# Altium schematic sheet Mostek H.SchDoc
size A4
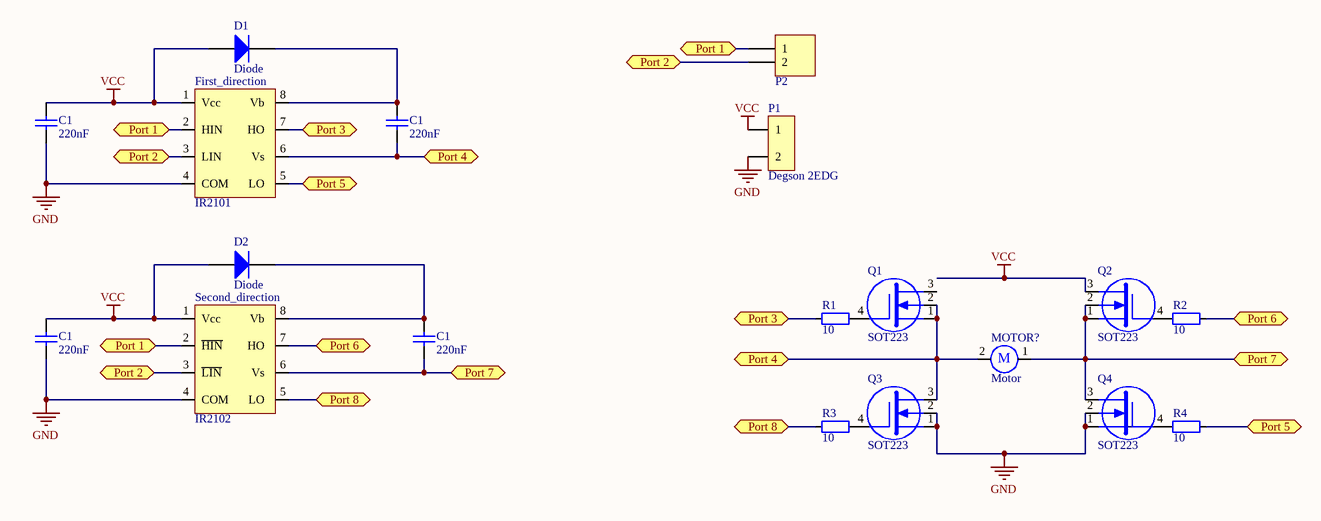
[diagram p0: Mostek H.SchDoc]

## Parts
(Parts that share a designator on the sheet are numbered #1, #2 ... from top to bottom, then left to right.)
C1#1  value 220nF  [CAPC0805]  (hidden comment: Cap)
C1#2  value 220nF  [CAPC0805]  (hidden comment: Cap)
C1#3  value 220nF  [CAPC0805]  (hidden comment: Cap)
C1#4  value 220nF  [CAPC0805]  (hidden comment: Cap)
D1  Diode  [SMC]
D2  Diode  [SMC]
First_direction  IR2101  [IR2101_DIP]
MOTOR?  Motor  [HDR1X2]
P1  Degson 2EDG  [2EDGRC]
P2  HDR1X2  [HDR1X2]  (value not drawn)
Q1  SOT223  [PCBComponent_1]
Q2  SOT223  [PCBComponent_1]
Q3  SOT223  [PCBComponent_1]
Q4  SOT223  [PCBComponent_1]
R1  10  [RESC1206]
R2  10  [RESC1206]
R3  10  [RESC1206]
R4  10  [RESC1206]
Second_direction  IR2102  [IR2101_DIP]

## Ports
Port 1, Port 2, Port 3, Port 4, Port 5, Port 6, Port 7, Port 8

## Nets
GND: C1#1.1 C1#3.1 First_direction.4(COM) P1.2 Q3.1 Q3.2 Q4.1 Q4.2 Second_direction.4(COM)
VCC: C1#1.2 C1#3.2 D1.1(A) D2.1(A) First_direction.1(Vcc) P1.1 Q2.3 Second_direction.1(Vcc)
Port 1: First_direction.2(HIN) P2.1 Second_direction.2(~{HIN}) ; port Port 1
Port 2: First_direction.3(LIN) P2.2 Second_direction.3(~{LIN}) ; port Port 2
Port 3: First_direction.7(HO) R1.1 ; port Port 3
Port 4: C1#2.1 First_direction.6(Vs) MOTOR?.2 Q1.1 Q1.2 Q3.3 ; port Port 4
Port 5: First_direction.5(LO) R4.2 ; port Port 5
Port 6: R2.2 Second_direction.7(HO) ; port Port 6
Port 7: C1#4.1 MOTOR?.1 Q2.1 Q2.2 Q4.3 Second_direction.6(Vs) ; port Port 7
Port 8: R3.1 Second_direction.5(LO) ; port Port 8
NetC1#2_2: C1#2.2 D1.2(K) First_direction.8(Vb)
NetC1#4_2: C1#4.2 D2.2(K) Second_direction.8(Vb)
NetQ1_4: Q1.4 R1.2
NetQ2_4: Q2.4 R2.1
NetQ3_4: Q3.4 R3.2
NetQ4_4: Q4.4 R4.1

Not connected (* = marked no-connect by the designer): Q1 3

## Notes on the sheet
- (in symbol Motor) M

## Library data of the parts
C1#1-C1#4 = Cap: Ceramic capacitor; Unit Price1: *; Unit Price2: *
D1 D2 = Diode: Default Diode; Published: 8-Jun-2000; LatestRevisionDate: 17-Jul-2002; LatestRevisionNote: Re-released for DXP Platform.; PackageVersion: Sep-1996; PackageReference: SMC; Publisher: Altium Limited; PackageDescription: DO-214-AB/SMC; 2 C-Bend Leads; Body 7.9 x 5.9 mm, inc. leads (LxW); Code_JEDEC: DO-214-AB
MOTOR? = Motor: Motor, General Kind; Published: 24-Mar-1999; LatestRevisionDate: 17-Jul-2002; LatestRevisionNote: Re-released for DXP Platform.; PackageReference: RB5-10.5; Publisher: Altium Limited
P2 = HDR1X2: Header, 2-Pin; LatestRevisionDate: 17-Jul-2002; LatestRevisionNote: Re-released for DXP Platform.; Publisher: Altium Limited
Q1-Q4 = Component_1
R1-R4 = RES: Resistior; Value: 10